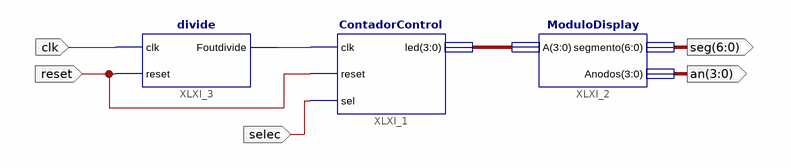
[diagram p0: schematic sheet 1]
// Xilinx ISE schematic SuperiorContadorControl.sch (spartan6) as structural Verilog: 3 symbols, 6 ports
module SuperiorContadorControl (
  input  clk,
  input  XLXN_5,
  input  reset,
  input  selec,
  output [6:0] seg,
  output [3:0] an
);

  wire XLXN_6;
  wire [3:0] XLXN_7;

  ContadorControl XLXI_1 (.clk(XLXN_6), .reset(reset), .sel(selec), .led(XLXN_7));
  ModuloDisplay XLXI_2 (.A(XLXN_7), .segmento(seg), .Anodos(an));
  divide XLXI_3 (.clk(clk), .reset(reset), .Foutdivide(XLXN_6));
endmodule
